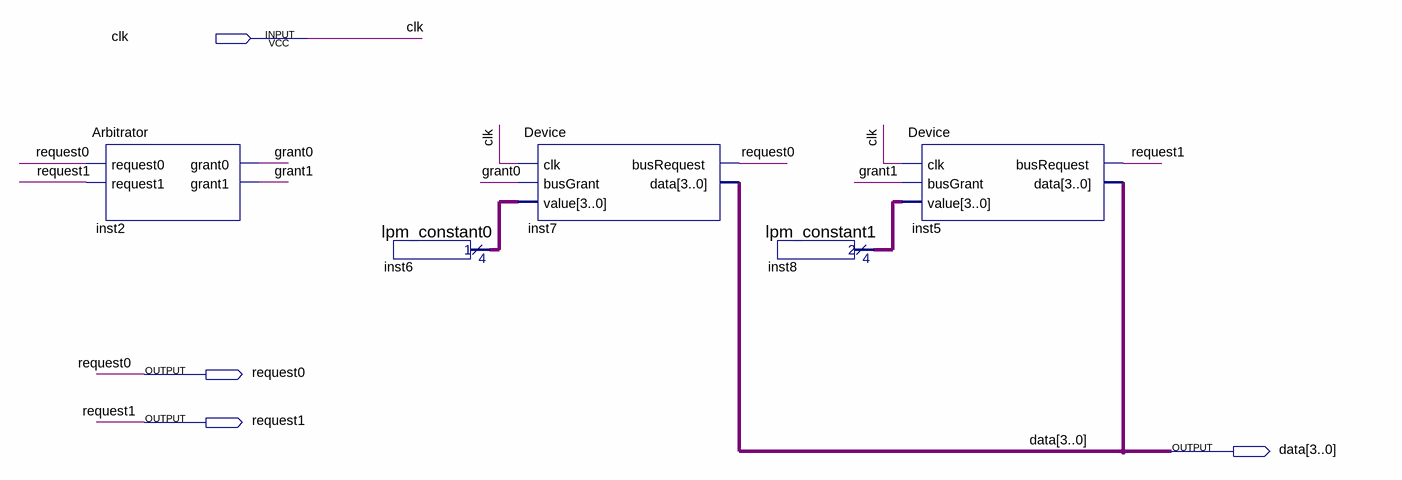
[diagram p0: schematic sheet]
// Quartus schematic Main.bdf as structural Verilog: 5 symbols, 4 pins
module Main (
  input  clk,
  output request0,
  output request1,
  output [3:0] data
);

  wire grant0, grant1;
  wire [3:0] inst6_result, inst8_result;

  Arbitrator inst2 (.request0(request0), .request1(request1), .grant0(grant0), .grant1(grant1));
  lpm_constant0 inst6 (.result(inst6_result));
  Device inst7 (.clk(clk), .busGrant(grant0), .value(inst6_result), .busRequest(request0), .data(data));
  lpm_constant1 inst8 (.result(inst8_result));
  Device inst5 (.clk(clk), .busGrant(grant1), .value(inst8_result), .busRequest(request1), .data(data));
endmodule
